# Altium schematic sheet bridge_bq79600.SchDoc
size A
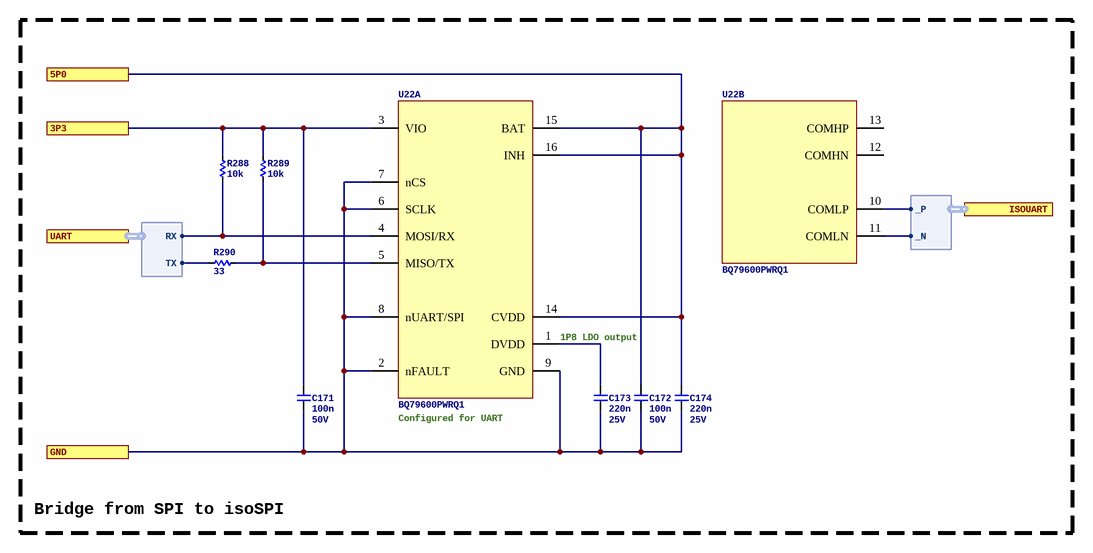
[diagram p0: bridge_bq79600.SchDoc]

## Parts
C171  Capacitance: 100n  Voltage Rating: 50V  [C0402]  (hidden comment: CL05B104KB54PNC)
C172  Capacitance: 100n  Voltage Rating: 50V  [C0402]  (hidden comment: CL05B104KB54PNC)
C173  Capacitance: 220n  Voltage Rating: 25V  [C0402]  (hidden comment: TMK105B7224KV-FR)
C174  Capacitance: 220n  Voltage Rating: 25V  [C0402]  (hidden comment: TMK105B7224KV-FR)
R288  value 10k  [R0402]  (hidden comment: 0402WGF1002TCE)
R289  value 10k  [R0402]  (hidden comment: 0402WGF1002TCE)
R290  value 33  [R0402]  (hidden comment: 0402WGF330JTCE)
U22  BQ79600PWRQ1  [TI_PW0016A]  (parts A,B of 2)

## Ports
3P3, 5P0, GND, ISOUART (harness DIFF), UART (harness UART)

## Harnesses
DIFF: _N, _P
UART: RX, TX

## Nets
3P3: C171.1 R288.2 R289.2 U22.3(VIO) ; port 3P3
5P0: C172.1 C174.1 U22.14(CVDD) U22.15(BAT) U22.16(INH) ; port 5P0
GND: C171.2 C172.2 C173.2 C174.2 U22.2(nFAULT) U22.6(SCLK) U22.7(nCS) U22.8(nUART/SPI) U22.9(GND) ; port GND
NetC173_1: C173.1 U22.1(DVDD)
NetR288_1: R288.1 U22.4(MOSI/RX) ; port UART.RX
NetR289_1: R289.1 R290.1 U22.5(MISO/TX)
NetR290_2: R290.2 ; port UART.TX
NetU22_10: U22.10(COMLP) ; port ISOUART._P
NetU22_11: U22.11(COMLN) ; port ISOUART._N

Not connected (* = marked no-connect by the designer): U22 12(COMHN) 13(COMHP)

## Notes on the sheet
- (near U22) 1P8 LDO output
- (near U22) Configured for UART
- Bridge from SPI to isoSPI

## Library data of the parts
C171 C172 = CL05B104KB54PNC: Manufacturer: Samsung Electro-Mechanics; Dielectric: X7R; ComponentLink1URL: https://wmsc.lcsc.com/wmsc/upload/file/pdf/v2/lcsc/2304140030_Samsung-Electro-Mechanics-CL05B104KB54PNC_C307331.pdf; ComponentLink1Description: Datasheet; Manufacturer Part Number: CL05B104KB54PNC; Package: 0402; Supplier 2: LCSC; Supplier Part Number 2: C307331
C173 C174 = TMK105B7224KV-FR: Manufacturer: Taiyo Yuden; Dielectric: X7R; ComponentLink1URL: https://datasheet.lcsc.com/lcsc/2009251208_Taiyo-Yuden-TMK105B7224KV-FR_C841047.pdf; ComponentLink1Description: Datasheet; Manufacturer Part Number: TMK105B7224KV-FR; Package: 0402; Supplier 2: LCSC; Supplier Part Number 2: C841047
R288 R289 = 0402WGF1002TCE: Manufacturer: UNI-ROYAL(Uniroyal Elec); Tolerance: 1%; Temperature Coefficient: Â±100ppm/â„ƒ; Power Rating (mW): 62.5; ComponentLink1Description: Datasheet; ComponentLink1URL: https://wmsc.lcsc.com/wmsc/upload/file/pdf/v2/lcsc/2206010100_UNI-ROYAL-Uniroyal-Elec-0402WGF1002TCE_C25744.pdf; Manufacturer Part Number: 0402WGF1002TCE; Package: 0402; Supplier 2: LCSC; Supplier Part Number 2: C25744
R290 = 0402WGF330JTCE: Manufacturer: UNI-ROYAL(Uniroyal Elec); Tolerance: 1%; Temperature Coefficient: Â±100ppm/â„ƒ; Power Rating (mW): 62.5; ComponentLink1Description: Datasheet; ComponentLink1URL: https://wmsc.lcsc.com/wmsc/upload/file/pdf/v2/lcsc/2205311900_UNI-ROYAL-Uniroyal-Elec-0402WGF330JTCE_C25105.pdf; Manufacturer Part Number: 0402WGF330JTCE; Package: 0402; Supplier 2: LCSC; Supplier Part Number 2: C25105
U22 = ISO_BQ79600PWRQ1: Automotive SPI/UART communication interface functional-safety compliant with automatic host wakeup; Manufacturer: Texas Instruments; Manufacturer Part Number: BQ79600PWRQ1; Supplier 1: Digikey; Supplier Part Number 1: 296-BQ79600PWRQ1CT-ND; ComponentLink1Description: Datasheet; ComponentLink1URL: https://www.ti.com/lit/ds/symlink/bq79600-q1.pdf; Supplier 2: LCSC; Supplier Part Number 2: C2869947